# Altium project Bachelor_Circui_Project.PrjPcb
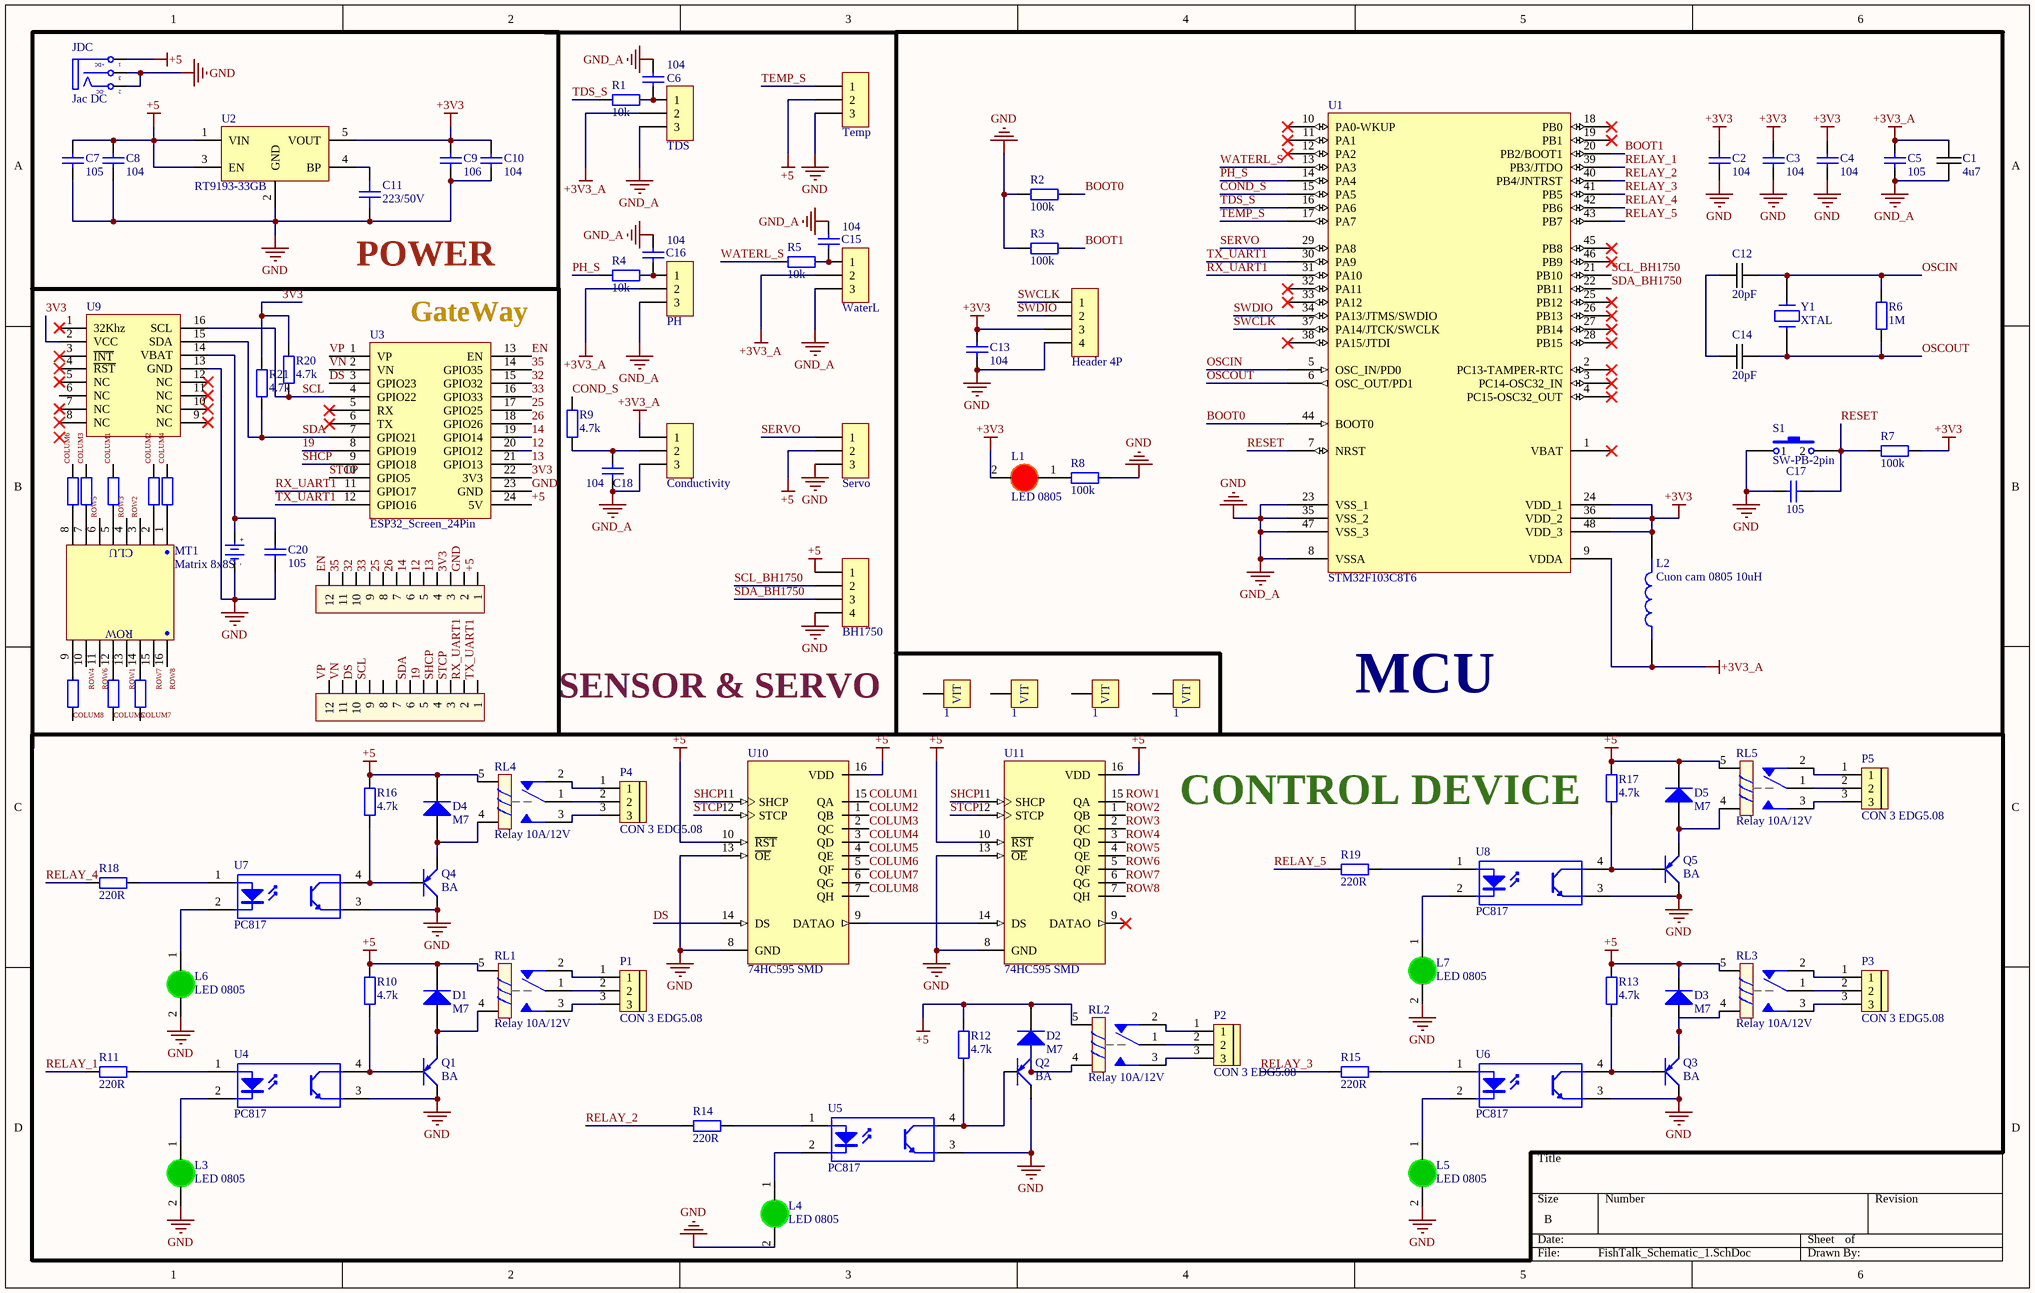
[diagram p0: FishTalk_Schematic_1.SchDoc]
1 sheet, 105 parts. Net scope: global (net labels, ports and power ports of the same name join across sheets).

## Sheet FishTalk_Schematic_1.SchDoc
size B; SheetNumber: 1; SheetTotal: 1

### Parts
BH17  BH1750  [XH2.54M-4]
BT1  CR1220 SMD  [DE PIN CR1220]  (value not drawn)
C1  4u7  [0603C-GENERIC]
C2  104  [tu 0603]
C3  104  [tu 0603]
C4  104  [tu 0603]
C5  105  [tu 0603]
C6  104  [tu 0603]
C7  105  [tu 0603]
C8  104  [tu 0603]
C9  106  [tu 0603]
C10  104  [tu 0603]
C11  223/50V  [CAPC-0603 (1608)]
C12  20pF  [0603C-GENERIC]
C13  104  [tu 0603]
C14  20pF  [0603C-GENERIC]
C15  104  [tu 0603]
C16  104  [tu 0603]
C17  105  [tu 0805]
C18  104  [tu 0603]
C20  105  [tu 0603]
COND  Conductivity  [XH2.54M-3]
D1  M7  [DIODE SMA]
D2  M7  [DIODE SMA]
D3  M7  [DIODE SMA]
D4  M7  [DIODE SMA]
D5  M7  [DIODE SMA]
H3  Header 4P  [XH2.54M-4]
H8  Header 12P  [XH2.54M-12]  (value not drawn)
H9  Header 12P  [XH2.54M-12]  (value not drawn)
JDC  Jac DC  [DC-IN]
L1  LED 0805  [LED-1206-Red]
L2  Cuon cam 0805 10uH  [Inductor 0805]
L3  LED 0805  [LED-1206-Green]
L4  LED 0805  [LED-1206-Green]
L5  LED 0805  [LED-1206-Green]
L6  LED 0805  [LED-1206-Green]
L7  LED 0805  [LED-1206-Green]
MT1  Matrix 8x8S  [Matrix]
P1  CON 3 EDG5.08  [Con 3 KF301 5.08]
P2  CON 3 EDG5.08  [Con 3 KF301 5.08]
P3  CON 3 EDG5.08  [Con 3 KF301 5.08]
P4  CON 3 EDG5.08  [Con 3 KF301 5.08]
P5  CON 3 EDG5.08  [Con 3 KF301 5.08]
PH  PH  [XH2.54M-3]
Q1  BA  [SOT23]
Q2  BA  [SOT23]
Q3  BA  [SOT23]
Q4  BA  [SOT23]
Q5  BA  [SOT23]
R1  10k  [tro smd 0603]
R2  100k  [tro smd 0603]
R3  100k  [tro smd 0603]
R4  10k  [tro smd 0603]
R5  10k  [tro smd 0603]
R6  1M  [tro smd 0603]
R7  100k  [tro smd 0603]
R8  100k  [tro smd 0603]
R9  4.7k  [tro smd 0603]
R10  4.7k  [tro smd 0603]
R11  220R  [tro smd 0603]
R12  4.7k  [tro smd 0603]
R13  4.7k  [tro smd 0603]
R14  220R  [tro smd 0603]
R15  220R  [tro smd 0603]
R16  4.7k  [tro smd 0603]
R17  4.7k  [tro smd 0603]
R18  220R  [tro smd 0603]
R19  220R  [tro smd 0603]
R20  4.7k  [tro smd 0603]
R21  4.7k  [tro smd 0603]
R22  560R  [tro smd 0603]  (value not drawn)
R23  560R  [tro smd 0603]  (value not drawn)
R24  560R  [tro smd 0603]  (value not drawn)
R25  560R  [tro smd 0603]  (value not drawn)
R26  560R  [tro smd 0603]  (value not drawn)
R27  560R  [tro smd 0603]  (value not drawn)
R28  560R  [tro smd 0603]  (value not drawn)
R29  560R  [tro smd 0603]  (value not drawn)
RL1  Relay 10A/12V  [RL_SPDT_10A]
RL2  Relay 10A/12V  [RL_SPDT_10A]
RL3  Relay 10A/12V  [RL_SPDT_10A]
RL4  Relay 10A/12V  [RL_SPDT_10A]
RL5  Relay 10A/12V  [RL_SPDT_10A]
S1  SW-PB-2pin  [SW_B3U-1000P]
SERVO  Servo  [XH2.54M-3]
TDS  TDS  [XH2.54M-3]
TEMP  Temp  [XH2.54M-3]
U1  STM32F103C8T6  [LQFP48_L]
U2  RT9193-33GB  [SOT23-5AL]
U3  ESP32_Screen_24Pin  [ESP32_Module_Screen_24Pin_N3D]
U4  PC817  [PhotoCoupler_SMD]
U5  PC817  [PhotoCoupler_SMD]
U6  PC817  [PhotoCoupler_SMD]
U7  PC817  [PhotoCoupler_SMD]
U8  PC817  [PhotoCoupler_SMD]
U9  DS3231 SMD  [SOIC 16]  (value not drawn)
U10  74HC595 SMD  [SOP 16]
U11  74HC595 SMD  [SOP 16]
VIT1  1  [Screw octagon 3.81mm]
VIT2  1  [Screw octagon 3.81mm]
VIT3  1  [Screw octagon 3.81mm]
VIT4  1  [Screw octagon 3.81mm]
WATER  WaterL  [XH2.54M-3]
Y1  XTAL  [XTAL]

### Blocks framed on the sheet
POWER: C7-C11 JDC U2
MCU: C1-C5 C12-C14 C17 H3 L1 L2 R2 R3 R6-R8 S1 U1 VIT1-VIT4 Y1
CONTROL DEVICE: D1-D5 L3-L7 P1-P5 Q1-Q5 R10-R19 RL1-RL5 U4-U8 U10 U11

### Nets
+3V3: C2.1 C3.1 C4.1 C9.1 C10.1 C13.1 H3.3 L1.2(K) L2.2 R7.2 U1.24(VDD_1) U1.36(VDD_2) U1.48(VDD_3) U2.5(VOUT)
+3V3_A: C1.1 C5.1 COND.1 L2.1 PH.2 TDS.2 U1.9(VDDA) WATER.2
+5: BH17.1 C7.1 C8.1 D1.2(K) D2.2(K) D3.2(K) D4.2(K) D5.2(K) H9.1 JDC.1(T) R10.2 R12.2 R13.2 R16.2 R17.2 RL1.5 RL2.5 RL3.5 RL4.5 RL5.5 SERVO.2 TEMP.2 U2.1(VIN) U2.3(EN) U3.24(5V) U10.10(~{RST}) U10.16(VDD) U11.10(~{RST}) U11.16(VDD)
GND: BH17.4 BT1.2(GND) C1.2 C2.2 C3.2 C4.2 C5.2 C6.1 C7.2 C8.2 C9.2 C10.2 C11.1 C13.2 C15.1 C16.1 C17.1 C18.2 C20.2 COND.3 H3.4 H9.2 JDC.2(TN) JDC.3(S) L3.2(K) L4.2(K) L5.2(K) L6.2(K) L7.2(K) PH.3 Q1.3(C) Q2.3(C) Q3.3(C) Q4.3(C) Q5.3(C) R2.1 R3.1 R8.2 S1.1 SERVO.3 TDS.3 TEMP.3 U1.8(VSSA) U1.23(VSS_1) U1.35(VSS_2) U1.47(VSS_3) U2.2(GND) U3.23(GND) U4.3(E) U5.3(E) U6.3(E) U7.3(E) U8.3(E) U9.13(GND) U10.8(GND) U10.13(~{OE}) U11.8(GND) U11.13(~{OE}) WATER.3  [also labelled GND_A]
3V3: H9.3 R20.2 R21.2 U3.22(3V3) U9.2(VCC)
12: H9.5 U3.20(GPIO12)
13: H9.4 U3.21(GPIO13)
14: H9.6 U3.19(GPIO14)
19: H8.5 U3.8(GPIO19)
25: H9.8 U3.17(GPIO25)
26: H9.7 U3.18(GPIO26)
32: H9.10 U3.15(GPIO32)
33: H9.9 U3.16(GPIO33)
35: H9.11 U3.14(GPIO35)
BOOT0: R2.2 U1.44(BOOT0)
BOOT1: R3.2 U1.20(PB2/BOOT1)
COLUM1: R24.2 U10.15(QA)
COLUM2: R25.2 U10.1(QB)
COLUM3: R23.2 U10.2(QC)
COLUM4: R26.2 U10.3(QD)
COLUM5: R28.1 U10.4(QE)
COLUM6: R22.2 U10.5(QF)
COLUM7: R29.1 U10.6(QG)
COLUM8: R27.1 U10.7(QH)
COND_S: R9.1 U1.15(PA5)
DS: H8.10 U3.3(GPIO23) U10.14(DS)
EN: H9.12 U3.13(EN)
OSCIN: C12.2 R6.2 U1.5(OSC_IN/PD0) Y1.2
OSCOUT: C14.2 R6.1 U1.6(OSC_OUT/PD1) Y1.1
PH_S: R4.1 U1.14(PA4)
RELAY_1: R11.1 U1.39(PB3/JTDO)
RELAY_2: R14.1 U1.40(PB4/JNTRST)
RELAY_3: R15.1 U1.41(PB5)
RELAY_4: R18.1 U1.42(PB6)
RELAY_5: R19.1 U1.43(PB7)
RESET: C17.2 R7.1 S1.2 U1.7(NRST)
ROW1: MT1.13(H4) U11.15(QA)
ROW2: MT1.3(C3) U11.1(QB)
ROW3: MT1.4(C4) U11.2(QC)
ROW4: MT1.10(H7) U11.3(QD)
ROW5: MT1.6(C6) U11.4(QE)
ROW6: MT1.11(H6) U11.5(QF)
ROW7: MT1.15(H2) U11.6(QG)
ROW8: MT1.16(H1) U11.7(QH)
RX_UART1: H8.2 U1.31(PA10) U3.11(GPIO17)
SCL: H8.9 R20.1 U3.4(GPIO22) U9.16(SCL)
SCL_BH1750: BH17.2 U1.21(PB10)
SDA: H8.6 R21.1 U3.7(GPIO21) U9.15(SDA)
SDA_BH1750: BH17.3 U1.22(PB11)
SERVO: SERVO.1 U1.29(PA8)
SHCP: H8.4 U3.9(GPIO18) U10.11(SHCP) U11.11(SHCP)
STCP: H8.3 U3.10(GPIO5) U10.12(STCP) U11.12(STCP)
SWCLK: H3.1 U1.37(PA14/JTCK/SWCLK)
SWDIO: H3.2 U1.34(PA13/JTMS/SWDIO)
TDS_S: R1.1 U1.16(PA6)
TEMP_S: TEMP.1 U1.17(PA7)
TX_UART1: H8.1 U1.30(PA9) U3.12(GPIO16)
VN: H8.11 U3.2(VN)
VP: H8.12 U3.1(VP)
WATERL_S: R5.1 U1.13(PA3)
NetBT1_1: BT1.1(+3V) C20.1 U9.14(VBAT)
NetC6_2: C6.2 R1.2 TDS.1
NetC11_2: C11.2 U2.4(BP)
NetC12_1: C12.1 C14.1
NetC15_2: C15.2 R5.2 WATER.1
NetC16_2: C16.2 PH.1 R4.2
NetC18_1: C18.1 COND.2 R9.2
NetD1_1: D1.1(A) Q1.2(E) RL1.4
NetD2_1: D2.1(A) Q2.2(E) RL2.4
NetD3_1: D3.1(A) Q3.2(E) RL3.4
NetD4_1: D4.1(A) Q4.2(E) RL4.4
NetD5_1: D5.1(A) Q5.2(E) RL5.4
NetL1_1: L1.1(A) R8.1
NetL3_1: L3.1(A) U4.2(K)
NetL4_1: L4.1(A) U5.2(K)
NetL5_1: L5.1(A) U6.2(K)
NetL6_1: L6.1(A) U7.2(K)
NetL7_1: L7.1(A) U8.2(K)
NetMT1_1: MT1.1(C1) R26.1
NetMT1_2: MT1.2(C2) R25.1
NetMT1_5: MT1.5(C5) R24.1
NetMT1_7: MT1.7(C7) R23.1
NetMT1_8: MT1.8(C8) R22.1
NetMT1_9: MT1.9(H8) R27.2
NetMT1_12: MT1.12(H5) R28.2
NetMT1_14: MT1.14(H3) R29.2
NetP1_1: P1.1 RL1.2
NetP1_2: P1.2 RL1.1
NetP1_3: P1.3 RL1.3
NetP2_1: P2.1 RL2.2
NetP2_2: P2.2 RL2.1
NetP2_3: P2.3 RL2.3
NetP3_1: P3.1 RL3.2
NetP3_2: P3.2 RL3.1
NetP3_3: P3.3 RL3.3
NetP4_1: P4.1 RL4.2
NetP4_2: P4.2 RL4.1
NetP4_3: P4.3 RL4.3
NetP5_1: P5.1 RL5.2
NetP5_2: P5.2 RL5.1
NetP5_3: P5.3 RL5.3
NetQ1_1: Q1.1(B) R10.1 U4.4(C)
NetQ2_1: Q2.1(B) R12.1 U5.4(C)
NetQ3_1: Q3.1(B) R13.1 U6.4(C)
NetQ4_1: Q4.1(B) R16.1 U7.4(C)
NetQ5_1: Q5.1(B) R17.1 U8.4(C)
NetR11_2: R11.2 U4.1(A)
NetR14_2: R14.2 U5.1(A)
NetR15_2: R15.2 U6.1(A)
NetR18_2: R18.2 U7.1(A)
NetR19_2: R19.2 U8.1(A)
NetU10_9: U10.9(DATAO) U11.14(DS)

Not connected (* = marked no-connect by the designer): H8 7 8; U1 1(VBAT)* 2(PC13-TAMPER-RTC)* 3(PC14-OSC32_IN)* 4(PC15-OSC32_OUT)* 10(PA0-WKUP)* 11(PA1)* 12(PA2)* 18(PB0)* 19(PB1)* 25(PB12)* 26(PB13)* 27(PB14)* 28(PB15)* 32(PA11)* 33(PA12)* 38(PA15/JTDI)* 45(PB8)* 46(PB9)*; U3 5(RX)* 6(TX)*; U9 1(32Khz)* 3(~{INT})* 4(~{RST})* 5(NC)* 6(NC) 7(NC)* 8(NC)* 9(NC)* 10(NC)* 11(NC)* 12(NC)*; U11 9(DATAO)*; VIT1 1; VIT2 1; VIT3 1; VIT4 1

### Notes on the sheet
- (near U3) GateWay
- SENSOR & SERVO
- (in symbol DCIN) +DC; -DC
- (in symbol De pin CR1220 SMD) +; -
- (in symbol LED 8x8S) CLU; ROW

### Library data of the parts
BH17 H3 = Header 4P 2.54 Duc Thang: Cắm; Ten_Linh_Kien: Header 4P XH2.54-4P Đực Thẳng; Don_Vi: Con; Ma_Hang: MH001285; Chung_Loai: Cắm
BT1 = De pin CR1220 SMD: Ten: Đế PIN CR1220 SMD; Ma_Hang: MH000833
C1 = 0603C-4U7-10V-X5R-TDK: CAPACITOR 0603 CERAMIC; Manufacturer Part Number: C1608X5R1A475K; Manufacturer: TDK Corporation; Reel: C13; Temperature Coefficient: X5R; Voltage - Rated: 10V; Capacitance: 4.7µF; Tolerance: ±10%; Supplier 1: Digi-Key; Mounting Type: Surface Mount, MLCC; Operating Temperature: -55°C ~ 85°C; Features: General Purpose; Lead Spacing: -; Package / Case: 0603 (1608 metric); Thickness: 0.80mm; Packaging: Tape & Reel (TR); Category: Capacitors; Supplier: Digi-Key; RoHS: RoHS Compliant; Supplier Part Number 1: 445-5170-2-ND; Supplier Part Number: 445-5170-2-ND
C2-C4 C6 C8 C10 C13 C15 C16 C18 = Tu 0603 104 50V 10%: Dán; Don_Vi: Con; So_Chan: 2; Ten_Linh_Kien: Tụ 0603 104-100nF 10% 50V; Ma_Hang: MH004568; Chung_Loai: Dán; Kieu_Chan: *
C5 C7 C20 = Tu 0603 105 16V 20%: Dán; Don_Vi: Con; So_Chan: 2; Ten_Linh_Kien: Tụ 0603 105-1uF 20% 16V; Ma_Hang: MH004574; Chung_Loai: Dán; Kieu_Chan: *
C9 = Tu 0603 106 16V 20%: Dán; Don_Vi: Con; So_Chan: 2; Ten_Linh_Kien: Tụ 0603-10uF 20% 16V; Ma_Hang: MH004848; Chung_Loai: Dán; Kieu_Chan: *
C11 = CC0603JRX7R9BB223: CAP CER 0.022uF 5% 50V X7R 0603; Solder: SMT; CompanyID: VT-00673; MPN: CC0603JRX7R9BB223; Value: 223/50V; Category: CAPACITOR; PinCount: 2
C12 C14 = 0603C-220PF-50V-C0G-MUR: CAPACITOR 0603 CERAMIC; Manufacturer: Murata Electronics North America; Manufacturer Part Number: GRM1885C1H221JA01D; Reel: C15; Tolerance: ±5%; Capacitance: 220pF; Temperature Coefficient: C0G, NP0; Voltage - Rated: 50V; Supplier 1: Digi-Key; RoHS: RoHS Compliant; Lead Spacing: -; Supplier: Digi-Key; Features: General Purpose; Package / Case: 0603 (1608 metric); Packaging: Tape & Reel (TR); Operating Temperature: -55°C ~ 125°C; Category: Capacitors; Thickness: 0.80mm; Mounting Type: Surface Mount, MLCC; Supplier Part Number 1: 490-1435-2-ND; Supplier Part Number: 490-1435-2-ND
C17 = Tu 0805 105 50V 10%: Dán; Don_Vi: Con; So_Chan: 2; Ten_Linh_Kien: Tụ 0805 105-1uF 10% 50V; Ma_Hang: MH004552; Chung_Loai: Dán; Kieu_Chan: *
COND PH SERVO TDS TEMP WATER = Header 3P 2.54 Duc Thang: Cắm; Ten_Linh_Kien: Header 3P XH2.54-3P Đực Thẳng; Don_Vi: Con; Ma_Hang: MH001292; Chung_Loai: Cắm
D1-D5 = Diode M7 ( 4007 ): Dán; Don_Vi: Con; Ten_Linh_Kien: Diode M7 1N4007 SMD 1A 1000V; Ma_Hang: MH000944; Chung_Loai: Dán; Ghi_Chu: *
H8 H9 = Header 12P: Cắm; Ten_Linh_Kien: Header 10P XH2.54-10P Đực Thẳng; Don_Vi: Con; Ma_Hang: MH001286; Chung_Loai: Cắm
JDC = DCIN: Jac DC input; Value: Jac DC
L1 = LED 1206 Do: Dán; Don_Vi: Con; Ma_Hang: MH002334; Ten_Linh_Kien: LED1206 Màu Đỏ (Red); Ghi_Chu: *; Kieu_Chan: *; Chung_Loai: Dán
L2 = Cuon cam 0805: 1.5ÂµH Unshielded Multilayer Inductor 700mA 220mOhm 0805 (2012 Metric); MF: Laird; MP: CPI0805G1R5R-10; Value: *; Price: None; Package: 0805 Laird; Availability: Not in stock; Check_prices: https://www.snapeda.com/parts/CPI0805G1R5R-10/Laird/view-part/5881135/?ref=eda; SnapEDA_Link: https://www.snapeda.com/parts/CPI0805G1R5R-10/Laird/view-part/5881135/?ref=snap
L3-L7 = LED 1206 Xanh La: Dán; Don_Vi: Con; Ma_Hang: MH002947; Ten_Linh_Kien: LED1206 Màu Xanh Lá (Green); Ghi_Chu: *; Kieu_Chan: *; Chung_Loai: Dán
MT1 = LED 8x8S: Matrix 8x8,  Single colour; Value: Matrix 8x8S
P1-P5 = CON 3 EDG5.08: Cắm; Ten_Linh_Kien: CON 3 2EDG5.08-3P 5.08MM ( Xanh Cong); Ma_Hang: MH000760; Ghi_Chu: *; Kieu_Chan: *; Don_Vi: Con; Chung_Loai: Cắm
Q1-Q5 = A1015 BA SMD: PNP 600mW, ECB
R1 R4 R5 R9 R10 R12 R13 R16 R17 R20 R21 = Tro 0603 1% 10k: Dán; Don_Vi: Con; So_Chan: 2; Ten_Linh_Kien: Trở 0603 1% 10k; Ma_Hang: MH006333; Chung_Loai: Dán; Kieu_Chan: *
R2 R3 R7 R8 R22-R29 = Tro 0603 5% 100k: Dán; So_Chan: 2; Ten_Linh_Kien: Trở 0603 5% 100k; Ma_Hang: MH006314; Don_Vi: Con; Chung_Loai: Dán; Kieu_Chan: *
R6 = Tro 0603 5% 1M: Dán; Don_Vi: Con; So_Chan: 2; Ten_Linh_Kien: Trở 0603 5% 1M; Ma_Hang: MH006909; Chung_Loai: Dán; Kieu_Chan: *
R11 R14 R15 R18 R19 = Tro 0603 5% 220R: Dán; Don_Vi: Con; So_Chan: 2; Ten_Linh_Kien: Trở 0603 5% 220R; Ma_Hang: MH006322; Chung_Loai: Dán; Kieu_Chan: *
RL1-RL5 = Relay 1: Relay SPDT,10A - 12VDC 5 Pin; Value: Relay SPDT, 10A, 12V
S1 = SW-PB-2pin: Switch; Published: 24-Mar-1999; LatestRevisionDate: 17-Jul-2002; LatestRevisionNote: Re-released for DXP Platform.; PackageReference: SPST-2; Publisher: Altium Limited
U1 = STM32F103C8T6: STM32 ARM-based 32-bit MCU with 64 Kbytes Flash, 48-pin LQFP, Industrial Temperature; Published: 30-May-2008; DatasheetVersion: rev6, Mar-2008; PackageVersion: Mar-2008; PackageReference: LQFP48; Publisher: Altium Limited; PackageDescription: 48-Pin Low-Profile Quad Flat Pack, 7 x 7 mm Body, 0.5 mm Pitch (LQFP48); ComponentLink1Description: Manufacturer Link; ComponentLink1URL: www.st.com/stm32; ComponentLink2Description: Datasheet; ComponentLink2URL: http://www.st.com/stonline/products/literature/ds/13587.pdf
U2 = RT9193: 1A Regulator
U4-U8 = PC817: 4-Pin Phototransistor Optocoupler; Published: 24-Mar-1999; LatestRevisionDate: 04-Mar-2005; LatestRevisionNote: Sch pins 3 & 4 Swapped.; DatasheetVersion: Nov-2003; PackageReference: DIP-4; Publisher: Altium Limited
U9 = DS3231 SMD: SOIC
U10 U11 = 74HC595 SMD: Dán; Ten_Linh_Kien: 74HC595D SOP16; Don_Vi: Con; Ma_Hang: MH000672; Ghi_Chu: *; Kieu_Chan: *; Chung_Loai: Dán
VIT1-VIT4 = VIT: Vit xuyen lo; Chung_Loai: Cắm; Ma_Hang: MH002051; Ten_Linh_Kien: CON 2 KF142R 5.08MM; Don_Vi: Con; Ghi_Chu: *; Kieu_Chan: *
Y1 = XTAL: Crystal